# Altium project TX_RC_V1.PrjPcb
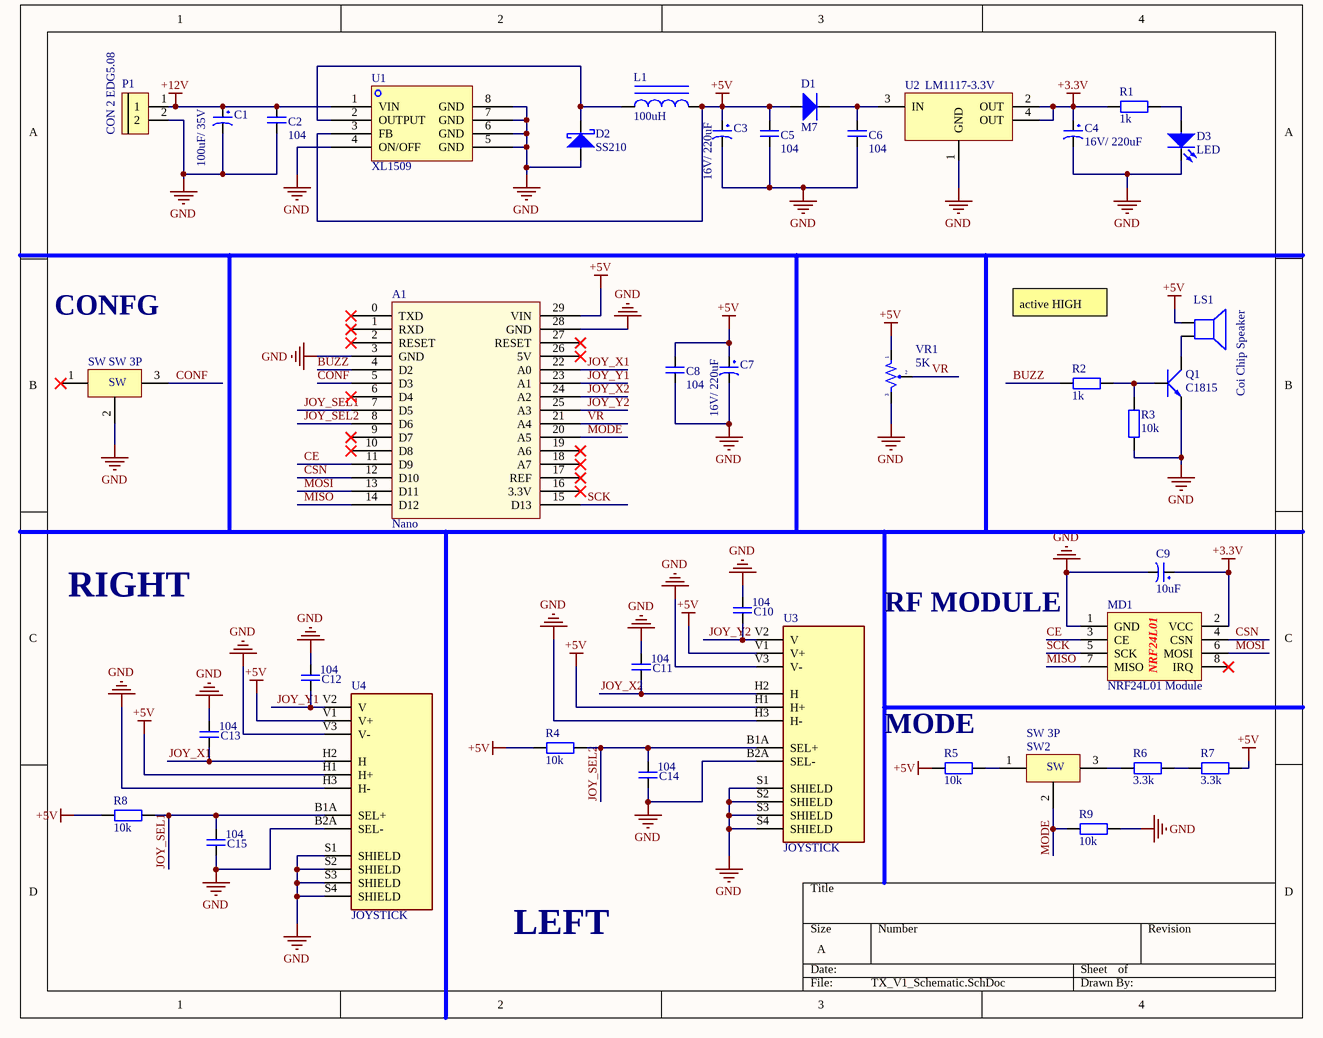
[diagram p0: TX_V1_Schematic.SchDoc]
1 sheet, 40 parts. Net scope: global (net labels, ports and power ports of the same name join across sheets).
Board file: PCB_TX_V1.PcbDoc

## Sheet TX_V1_Schematic.SchDoc
size A; SheetNumber: 1; SheetTotal: 1

### Parts
A1  Nano  [Arduino nano]
C1  100uF/ 35V  [CAP SMD ALUMINUM D8]
C2  104  [SM-0805]
C3  16V/ 220uF  [CAP SMD ALUMINUM D8]
C4  16V/ 220uF  [CAP SMD ALUMINUM D8]
C5  104  [SM-0805]
C6  104  [SM-0805]
C7  16V/ 220uF  [CAP SMD ALUMINUM D8]
C8  104  [SM-0805]
C9  10uF  [tu hoa 8mm]
C10  104  [SM-0805]
C11  104  [SM-0805]
C12  104  [SM-0805]
C13  104  [SM-0805]
C14  104  [SM-0805]
C15  104  [SM-0805]
D1  M7  [DO-214AC]
D2  SS210  [DO-214AC]
D3  LED  [LED-3MM GRE]
L1  100uH  [INDUCTOR SMD 7342 7.3X7.3X4.2mm]
LS1  Coi Chip Speaker  [Coi Chip Speacker]
MD1  NRF24L01 Module  [NRF24L01]
P1  CON 2 EDG5.08  [CON 2 2EDG5.08]
Q1  C1815  [SOT23B]
R1  1k  [RESISTOR SMD 0805]
R2  1k  [RESISTOR SMD 0805]
R3  10k  [RESISTOR SMD 0805]
R4  10k  [RESISTOR SMD 0805]
R5  10k  [RESISTOR SMD 0805]
R6  3.3k  [RESISTOR SMD 0805]
R7  3.3k  [RESISTOR SMD 0805]
R8  10k  [RESISTOR SMD 0805]
R9  10k  [RESISTOR SMD 0805]
SW  SW 3P  [MTS-102]
SW2  SW 3P  [MTS-102]
U1  XL1509  [SOP8]
U2  LM1117-3.3V  [SOT223-4N]
U3  JOYSTICK  [XDCR_COM-09032]
U4  JOYSTICK  [XDCR_COM-09032]
VR1  5K  [Bien Tro Volume Don]

### Nets
+3.3V: C4.1 C9.1 MD1.2(VCC) R1.1 U2.2(OUT) U2.4(OUT)
+5V: A1.29(VIN) C3.1 C5.2 C7.1 C8.2 D1.1 L1.2 LS1.1 R4.1 R5.2 R7.1 R8.1 U1.3(FB) U3.H1(H+) U3.V1(V+) U4.H1(H+) U4.V1(V+) VR1.1
+12V: C1.1 C2.2 P1.1 U1.1(VIN)
GND: A1.3(GND) A1.28(GND) C1.2 C2.1 C3.2 C4.2 C5.1 C6.1 C7.2 C8.1 C9.2 C10.2 C11.2 C12.2 C13.2 C14.1 C15.1 D2.1 D3.2 MD1.1(GND) P1.2 Q1.1(E) R3.2 R9.1 SW.2 U1.4(ON/OFF) U1.5(GND) U1.6(GND) U1.7(GND) U1.8(GND) U2.1(GND) U3.B2A(SEL-) U3.H3(H-) U3.S1(SHIELD) U3.S2(SHIELD) U3.S3(SHIELD) U3.S4(SHIELD) U3.V3(V-) U4.B2A(SEL-) U4.H3(H-) U4.S1(SHIELD) U4.S2(SHIELD) U4.S3(SHIELD) U4.S4(SHIELD) U4.V3(V-) VR1.3
BUZZ: A1.4(D2) R2.2
CE: A1.11(D9) MD1.3(CE)
CONF: A1.5(D3) SW.3
CSN: A1.12(D10) MD1.4(CSN)
JOY_SEL1: A1.7(D5) C15.2 R8.2 U4.B1A(SEL+)
JOY_SEL2: A1.8(D6) C14.2 R4.2 U3.B1A(SEL+)
JOY_X1: A1.22(A0) C13.1 U4.H2(H)
JOY_X2: A1.24(A2) C11.1 U3.H2(H)
JOY_Y1: A1.23(A1) C12.1 U4.V2(V)
JOY_Y2: A1.25(A3) C10.1 U3.V2(V)
MISO: A1.14(D12) MD1.7(MISO)
MODE: A1.20(A5) R9.2 SW2.2
MOSI: A1.13(D11) MD1.6(MOSI)
SCK: A1.15(D13) MD1.5(SCK)
VR: A1.21(A4) VR1.2
NetC6_2: C6.2 D1.2 U2.3(IN)
NetD2_2: D2.2 L1.1 U1.2(OUTPUT)
NetD3_1: D3.1 R1.2
NetLS1_2: LS1.2 Q1.2(C)
NetQ1_3: Q1.3(B) R2.1 R3.1
NetR5_1: R5.1 SW2.1
NetR6_1: R6.1 R7.2
NetR6_2: R6.2 SW2.3

Not connected (* = marked no-connect by the designer): A1 0(TXD)* 1(RXD)* 2(RESET)* 6(D4)* 9(D7)* 10(D8)* 16(3.3V)* 17(REF)* 18(A7)* 19(A6)* 26(5V)* 27(RESET)*; MD1 8(IRQ)*; SW 1*

### Notes on the sheet
- CONFG
- active HIGH
- RIGHT
- RF MODULE
- (near R5) MODE
- LEFT
- (in symbol NRF24L01 Module) NRF24L01
- (in symbol SW 3P) SW

### Library data of the parts
A1 = Arduino Nano
C1 C3 C4 C7 = Cap_Polar
C2 C5 C6 C8 C10-C15 = Cap_Non-Polar
C9 = Tu Hoa 100uF 35V 8x11: Cắm; Don_Vi: Con; So_Chan: 2; Ten_Linh_Kien: Tụ Hóa 100uF 35V 8x11MM; Ma_Hang: MH002807; Chung_Loai: Cắm; Kieu_Chan: *
D1 = Diode Standard: Part Number: LED 3 ly Single Colour; Pricing: *
D2 = Diode Schottky: Part Number: LED 3 ly Single Colour; Pricing: *
D3 = LED: LED Single; Value: LED 3 ly Single Colour
L1 = Inductor Iron: Magnetic-Core Inductor; Value: 150 mH
LS1 = Coi Chip Speaker: Còi chip
P1 = CON 2 EDG5.08: Cắm; Ten_Linh_Kien: CON 2 2EDG5.08-2P 5.08MM ( Xanh Cong); Ma_Hang: MH000759; Ghi_Chu: *; Don_Vi: Con; Kieu_Chan: *; Chung_Loai: Cắm
Q1 = C1815: NPN 600mW, ECB; Value: C1815
R1-R9 = Resistor
U1 = XL1509: IC power sop8
U2 = LM1117: 800mA Low-Dropout Linear Regulator; Creator: Nguyen Ba Bien; Website: http://group3i.net
U3 U4 = JOYSTICK: Thumb Joystick; MP: COM-09032; Price: None; Availability: Unavailable; Value: *; Package: None
VR1 = Triet Ap Don 5k: Cắm; Don_Vi: Con; Ten_Linh_Kien: Triết Áp Đơn B5K; Ma_Hang: MH001416; Kieu_Chan: *; Chung_Loai: Cắm